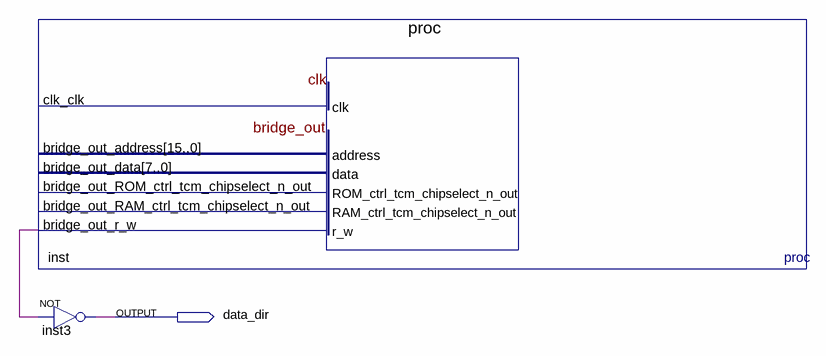
[diagram p0: schematic sheet]
// Quartus schematic osc.bdf as structural Verilog: 2 symbols, 1 pins
module osc (
  output data_dir
);

  wire inst_bridge_out_r_w;

  proc inst (.bridge_out_r_w(inst_bridge_out_r_w));  // open: clk_clk, bridge_out_address, bridge_out_ROM_ctrl_tcm_chipselect_n_out, bridge_out_RAM_ctrl_tcm_chipselect_n_out, bridge_out_data
  not inst3 (data_dir, inst_bridge_out_r_w);
endmodule
